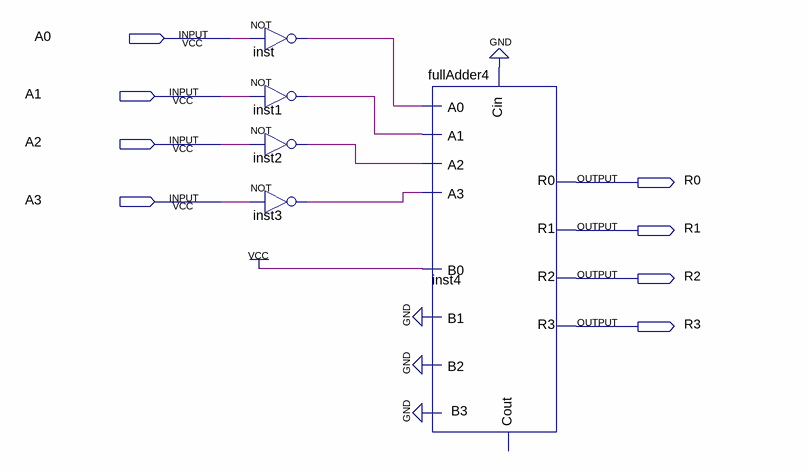
[diagram p0: schematic sheet]
// Quartus schematic inversor.bdf as structural Verilog: 5 symbols, 8 pins
module inversor (
  input  A0,
  input  A1,
  input  A2,
  input  A3,
  output R0,
  output R1,
  output R2,
  output R3
);

  wire inst1_out, inst2_out, inst3_out, inst_out;

  not inst (inst_out, A0);
  not inst1 (inst1_out, A1);
  not inst2 (inst2_out, A2);
  not inst3 (inst3_out, A3);
  fullAdder4 inst4 (
    .A0(inst_out), .B0(1'b1), .Cin(1'b0), .A1(inst1_out), .A2(inst2_out), .A3(inst3_out), .B3(1'b0), .R0(R0),
    .R1(R1), .R2(R2), .R3(R3));  // open: B1, B2, Cout
endmodule
